# Altium schematic sheet Sheet2.SchDoc
size A
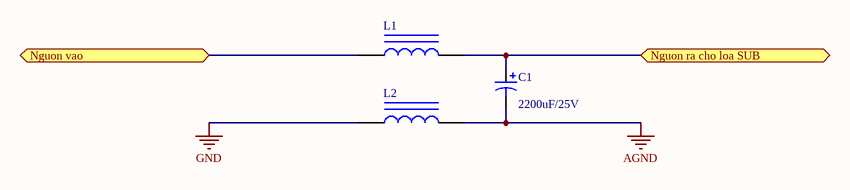
[diagram p0: Sheet2.SchDoc]

## Parts
C1  value 2200uF/25V  [RB7.6-15]
L1  (no value)  [AXIAL-0.9]
L2  (no value)  [AXIAL-0.9]

## Ports
Nguon ra cho loa SUB, Nguon vao

## Nets
AGND: C1.2 L2.2
GND: L2.1
Nguon ra cho loa SUB: C1.1 L1.2 ; port Nguon ra cho loa SUB
Nguon vao: L1.1 ; port Nguon vao

## Library data of the parts
C1 = Cap Pol1: Polarized Capacitor (Radial); Published: 8-Jun-2000; LatestRevisionDate: 17-Jul-2002; LatestRevisionNote: Re-released for DXP Platform.; PackageReference: RB7.6-15; Publisher: Altium Limited; PackageDescription: Polarized Capacitor (Radial); 2 Leads
L1 L2 = Inductor Iron: Magnetic-Core Inductor; Published: 24-Mar-1999; LatestRevisionDate: 17-Jul-2002; LatestRevisionNote: Re-released for DXP Platform.; PackageReference: AXIAL-0.9; Publisher: Altium Limited; PackageDescription: Axial Device, Thru-Hole; 2 Leads; 0.9 in Pin Spacing